# EAGLE design LightSense (EAGLE 5.04)
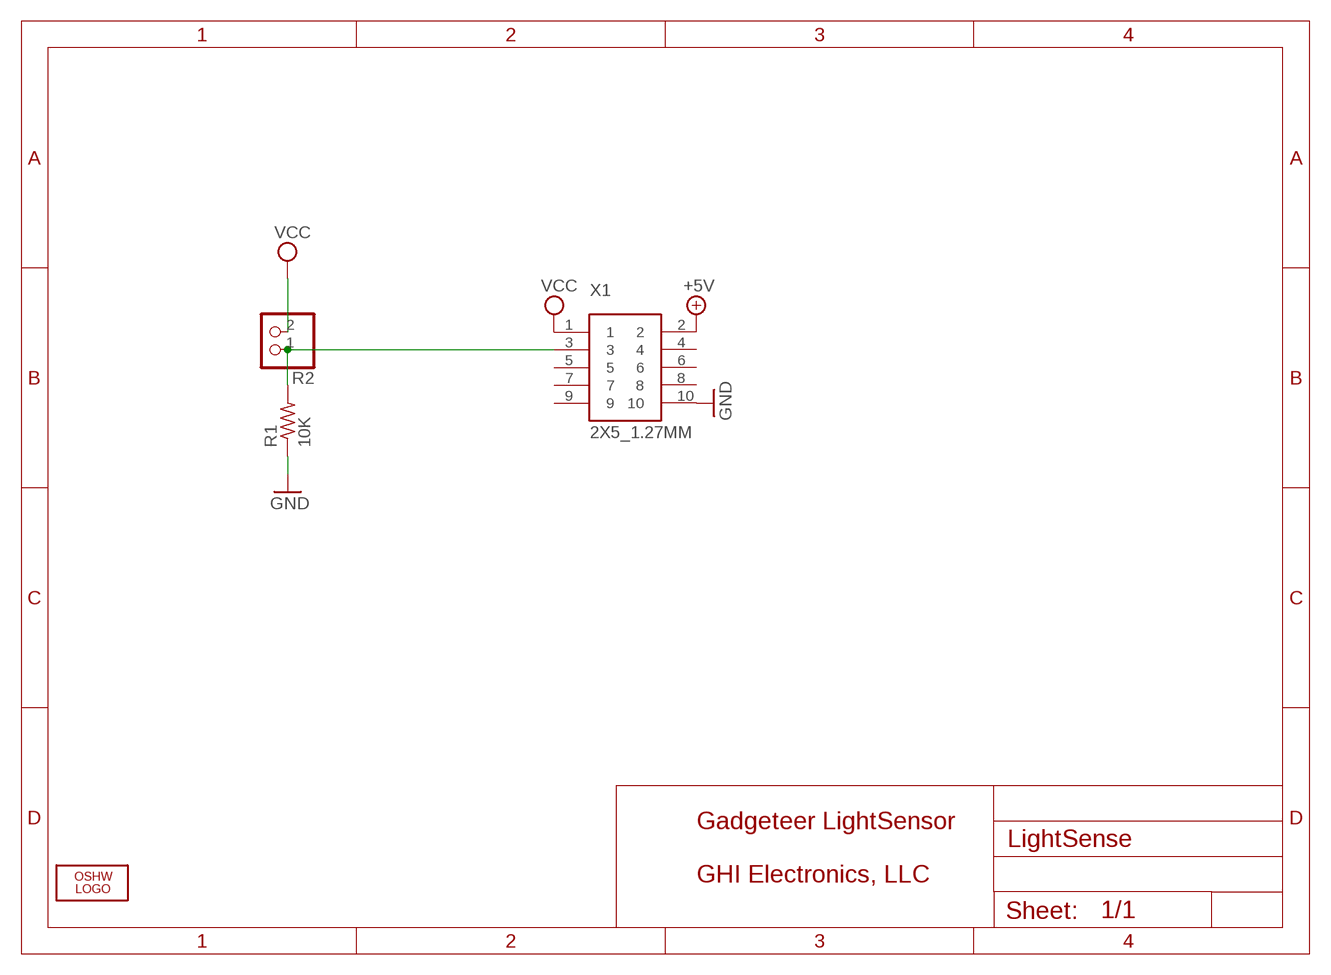
[diagram p0: schematic, sheet 1]

## Parts
LOGO1  LOGO-OSHW-FILLX0200-NT  [OSHW_FILLX200_NOTEXT]
R1  10K  R-US_R0603  [R0603]
R2  PINHD-1X2  [1X02]
X1  2X5_1.27MM  [2X5_1.27MM]

## Nets
+5V [power]: X1.2
GND [power]: R1.1 X1.10
N$16: R1.2 R2.1 X1.3
VCC [power]: R2.2 X1.1
Unconnected: X1.4 X1.5 X1.6 X1.7 X1.8 X1.9

## Notes on the sheet
- Gadgeteer LightSensor
- GHI Electronics, LLC

## Library data of the parts
LOGO1 = Logo:LOGO-OSHW-FILL
R1 = rcl:R-US_: RESISTOR, American symbol
R2 = pinhead:PINHD-1X2: PIN HEADER
X1 = GHI:2X5_1.27MM

## Net classes
0 default: width 0.254 mm, drill 0.381 mm, clearance 0.203 mm

## Board
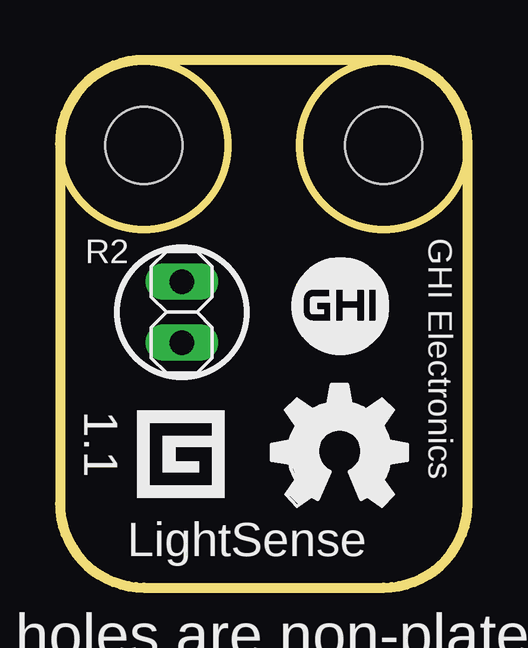
[diagram p1: board, top side]
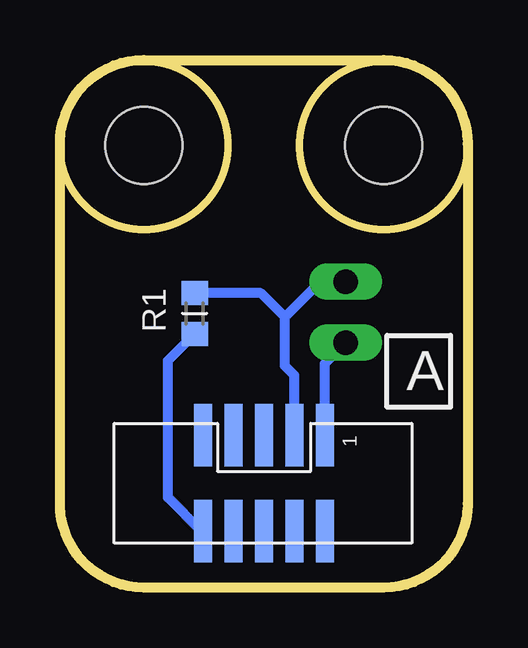
[diagram p2: board, bottom side, seen from below]

Size 17 x 22 mm. Coordinates in mm from the lower left corner, seen from the top.
Outline: 13.5,0 arc90 17,3.5 17,18.5 arc90 13.5,22 3.5,22 arc90 0,18.5 0,3.5 arc90 3.5,0 13.5,0
Outline: circle at 3.5,18.44 radius 3.5
Outline: circle at 13.5,18.44 radius 3.5
Copper layers (1+16): Top 0.035mm / dielectric 1.5mm / Bottom 0.035mm
Design rules "default *": minimum track width 8mil, minimum drill 12mil, track to track 8mil, track to pad 8mil, pad to pad 8mil, via to via 8mil, smd to smd 8mil, copper to edge 15mil, drill to drill 8mil, minimum pad ring 10mil, minimum via ring 7mil, stop-mask expansion 4mil, vias tented up to drill 50mil, thermal gap 10mil
Holes 3.2 mm at 13.5,18.44 3.5,18.44

### Footprints (pad centres in the part's own frame; a part is rotated, then mirrored left to right if it is on the bottom)
R0603 = smd 1 x 1.1: 1 -0.85,0; 2 0.85,0
1X02 = drill 1.016 long: 1 -1.27,0; 2 1.27,0
2X5_1.27MM = smd 2.6 x 0.74: 1 -2,2.58; 2 2,2.58; 3 -2,1.31; 4 2,1.31; 5 -2,0.04; 6 2,0.04; 7 -2,-1.23; 8 2,-1.23; 9 -2,-2.5; 10 2,-2.5

### Placement (x,y rotation side)
LOGO1  8.82,3.4 0 top
R1  11.38,11.43 90 bottom
R2  5.08,11.48 270 top
X1  8.53,4.35 270 bottom

### Tracks (layer width: path | path; a pad name or v marks a point on that pad's centre or on a via)
GND
  Bottom 0.406: X1.10 11.09,2.35 12.5,3.76 12.5,9.46 R1.1
N$16
  Bottom 0.406: X1.3 7.22,8.85 7.62,9.25 7.62,11.28 | 7.62,11.28 5.99,12.9 5.23,12.9 R2.1 | R1.2 8.62,12.28 7.62,11.28
VCC
  Bottom 0.406: X1.1 5.95,9.34 R2.2

### Text on the board
tPlace: GHI Electronics | 1.1 | LightSense | corner holes are non-plated | Black PCB with white print | Do not add any manufacturing Code!
bPlace: A
201bmp: C:/Users/Gus Issa/Desktop/GHILogo_BW.bmp